# Altium project ArduinoUnoSheild.PrjPcb
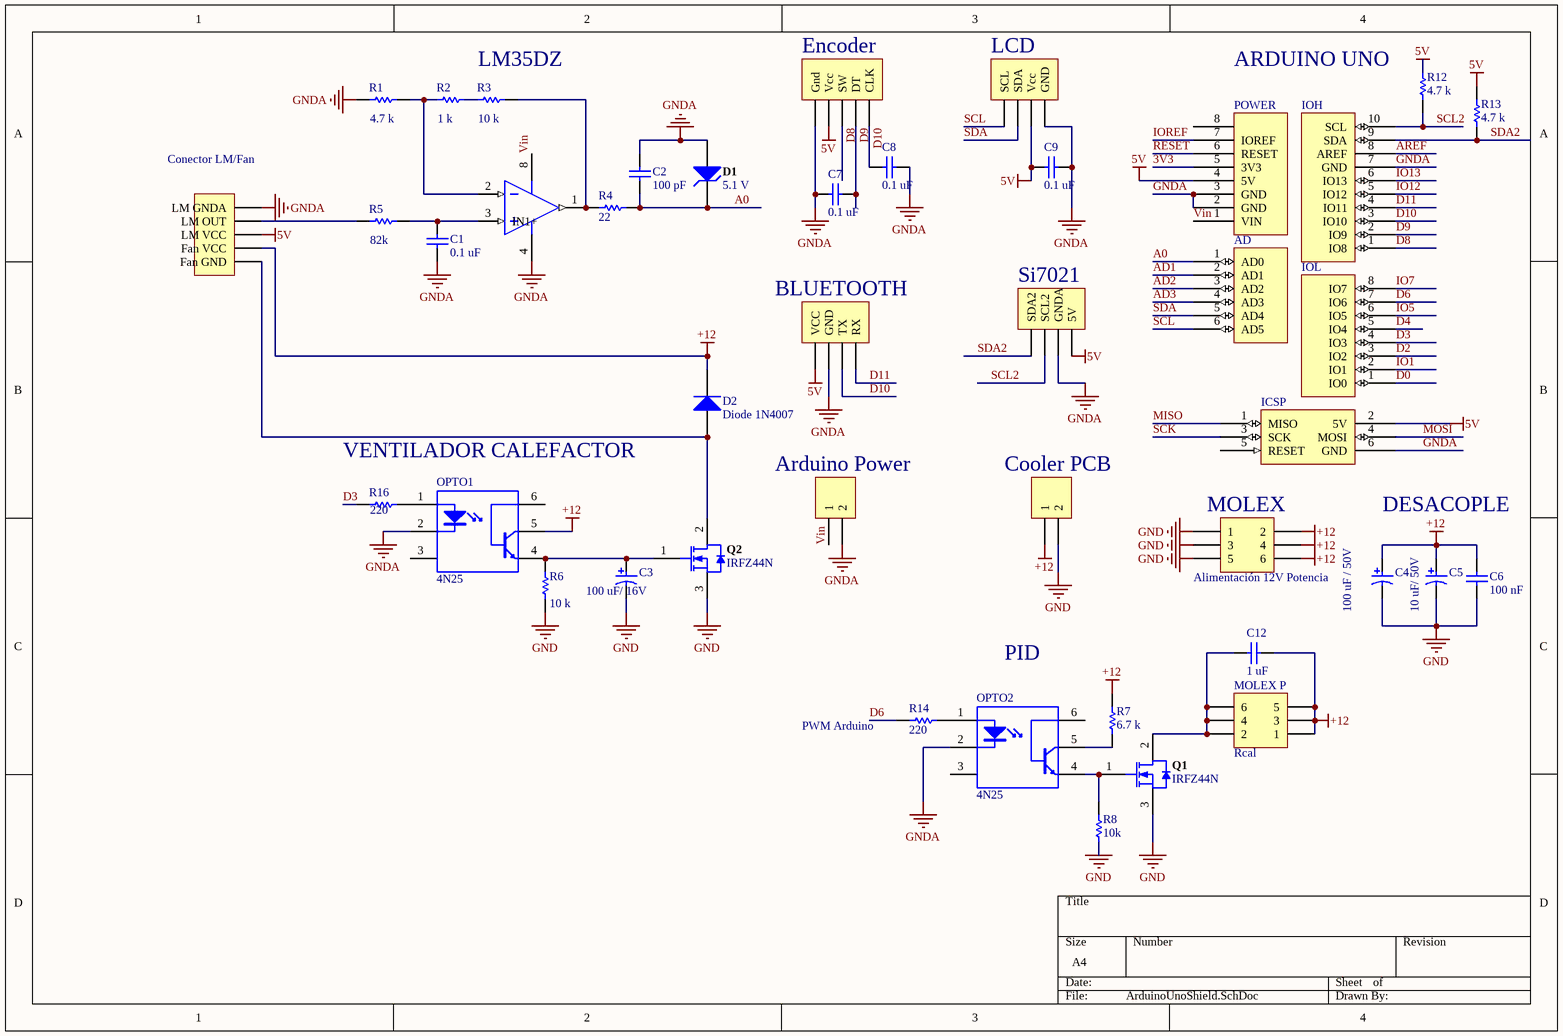
[diagram p0: ArduinoUnoShield.SchDoc]
1 sheet, 43 parts. Net scope: global (net labels, ports and power ports of the same name join across sheets).

## Sheet ArduinoUnoShield.SchDoc
size A4

### Parts
AD  AD  [Header 6x1 8.5mm]  (value not drawn)
Arduino_Power  Cooler  [HDR1X2]  (value not drawn)
BT  BLUETOOTH  [HDR1X4]
C1  0.1 uF  [KEMT-C315-THT-2]
C2  100 pF  [KEMT-C315-THT-2]
C3  100 uF/ 16V  [CAPPR55-250-1120X630X1220]
C4  100 uF / 50V  [CAPPR55-250-1120X630X1220]
C5  10 uF/ 50V  [CAPPR55-250-1120X630X1220]
C6  100 nF  [KEMT-C315-THT-2]
C7  0.1 uF  [KEMT-C315-THT-2]
C8  0.1 uF  [KEMT-C315-THT-2]
C9  0.1 uF  [KEMT-C315-THT-2]
C12  1 uF  [KEMT-C315-THT-2]
Conector_LM/Fan  Header 5  [HDR1X5]  (value not drawn)
Cooler_PCB  Cooler  [HDR1X2]  (value not drawn)
D1  5.1 V  [FAIR-DO-41-2_V]
D2  Diode 1N4007  [DO-41]
Encoder  Encoder  [HDR1X5]  (value not drawn)
ICSP  ICSP  [ICSP]  (value not drawn)
IOH  IOH  [Header 10x1 8.5mm]  (value not drawn)
IOL  IOL  [Header 8x1 8.5mm]  (value not drawn)
LCD  LCD  [HDR1X4]  (value not drawn)
MOLEX  Alimentación 12V Potencia  [HDR2X3]
MOLEX_P  Rcal  [HDR2X3]
OPTO1  4N25  [LTST-DIP-6_A]
OPTO2  4N25  [LTST-DIP-6_A]
POWER  POWER_UNO  [Header 8x1 8.5mm]  (value not drawn)
Q1  IRFZ44N  [VISH-TO-220AB-3_A]
Q2  IRFZ44N  [VISH-TO-220AB-3_A]
R1  4.7 k  [AXIAL-0.3]
R2  1 k  [AXIAL-0.3]
R3  10 k  [AXIAL-0.3]
R4  22  [AXIAL-0.3]
R5  82k  [AXIAL-0.3]
R6  10 k  [AXIAL-0.3]
R7  6.7 k  [AXIAL-0.3]
R8  value 10k  [AXIAL-0.3]  (hidden comment: 10 k)
R12  4.7 k  [AXIAL-0.3]
R13  4.7 k  [AXIAL-0.3]
R14  220  [AXIAL-0.3]
R16  220  [AXIAL-0.3]
Si7021  (no value)  [HDR1X4]
U1  (no value)  [ONSC-PDIP-8-626-05]  (part A of 2)

### Nets
5V: BT.1(VCC) C9.2 Conector_LM/Fan.4(LM_VCC) Encoder.2(Vcc) ICSP.2(5V) LCD.3(Vcc) POWER.4(5V) R12.2 R13.2 Si7021.4(5V)
+12: C4.1 C5.1 C6.2 C12.1 Conector_LM/Fan.2(Fan_VCC) Cooler_PCB.1 D2.2(K) MOLEX.2 MOLEX.4 MOLEX.6 MOLEX_P.1 MOLEX_P.3 MOLEX_P.5 OPTO1.5(C) R7.2
GND: C3.2 C4.2 C5.2 C6.1 Cooler_PCB.2 MOLEX.1 MOLEX.3 MOLEX.5 Q1.3(S) Q2.3(S) R6.2 R8.1
GNDA: Arduino_Power.2 BT.2(GND) C1.1 C2.1 C7.1 C8.2 C9.1 Conector_LM/Fan.5(LM_GNDA) D1.1(A) Encoder.1(Gnd) ICSP.6(GND) IOH.7(GND) LCD.4(GND) OPTO1.2(C) OPTO2.2(C) POWER.2(GND) POWER.3(GND) R1.1 Si7021.3(GNDA) U1.4(VEE)
3V3: POWER.5(3V3)
A0: AD.1(AD0) C2.2 D1.2(K) R4.1
AD1: AD.2(AD1)
AD2: AD.3(AD2)
AD3: AD.4(AD3)
AREF: IOH.8(AREF)
D0: IOL.1(IO0)
D2: IOL.3(IO2)
D3: IOL.4(IO3) R16.1
D4: IOL.5(IO4)
D6: IOL.7(IO6) R14.2
D8: Encoder.3(SW) IOH.1(IO8)
D9: C7.2 Encoder.4(DT) IOH.2(IO9)
D10: BT.3(TX) C8.1 Encoder.5(CLK) IOH.3(IO10)
D11: BT.4(RX) IOH.4(IO11)
IO1: IOL.2(IO1)
IO5: IOL.6(IO5)
IO7: IOL.8(IO7)
IO12: IOH.5(IO12)
IO13: IOH.6(IO13)
IOREF: POWER.7(IOREF)
MISO: ICSP.1(MISO)
MOSI: ICSP.4(MOSI)
RESET: POWER.6(RESET)
SCK: ICSP.3(SCK)
SCL: AD.6(AD5) LCD.1(SCL)
SCL2: IOH.10(SCL) R12.1 Si7021.2(SCL2)
SDA: AD.5(AD4) LCD.2(SDA)
SDA2: IOH.9(SDA) R13.1 Si7021.1(SDA2)
Vin: Arduino_Power.1 POWER.1(VIN) U1.8(VCC)
NetC1_2: C1.2 R5.2 U1.3(IN1+)
NetC3_1: C3.1 OPTO1.4(E) Q2.1(G) R6.1
NetC12_2: C12.2 MOLEX_P.2 MOLEX_P.4 MOLEX_P.6 Q1.2(D)
NetConector_LM/Fan_1: Conector_LM/Fan.1(Fan_GND) D2.1(A) Q2.2(D)
NetConector_LM/Fan_3: Conector_LM/Fan.3(LM_OUT) R5.1
NetOPTO1_1: OPTO1.1(A) R16.2
NetOPTO2_1: OPTO2.1(A) R14.1
NetOPTO2_4: OPTO2.4(E) Q1.1(G) R8.2
NetOPTO2_5: OPTO2.5(C) R7.1
NetR1_2: R1.2 R2.1 U1.2(IN1-)
NetR2_2: R2.2 R3.1
NetR3_2: R3.2 R4.2 U1.1(OUT1)

Not connected (* = marked no-connect by the designer): ICSP 5(RESET); OPTO1 3(NC) 6(B); OPTO2 3(NC) 6(B); POWER 8

### Notes on the sheet
- LM35DZ
- ARDUINO UNO
- VENTILADOR CALEFACTOR
- DESACOPLE
- PID
- (near R14) PWM Arduino

### Library data of the parts
Arduino_Power Cooler_PCB = Header 2: Header, 2-Pin; LatestRevisionDate: 17-Jul-2002; LatestRevisionNote: Re-released for DXP Platform.; Publisher: Altium Limited
BT LCD Si7021 = Header 4: Header, 4-Pin; LatestRevisionDate: 17-Jul-2002; LatestRevisionNote: Re-released for DXP Platform.; Publisher: Altium Limited
C1 C2 C6-C9 C12 = CMP-1664-00010-1: Capacitor, Ceramic, 1000 pF, +/-10 %, 100 V, X7R, -55 to 125 degC, 2-Pin THD, RoHS, Bulk; Max Supply Voltage: 3.6 V; Case\Package: DFN; Nominal Supply Voltage: 3 V; Min Supply Voltage: 1.5 V; Interface: Serial; ComponentLink1Description: Manufacturer URL; ComponentLink1URL: http://www.kemet.com/; DatasheetVersion: Aug-16; Max Operating Temperature: 125 degC; REACH SVHC: Unknown; Min Operating Temperature: -40 degC; Radiation Hardening: No; Mount: Surface Mount; Packaging: Tape and Reel; PackageDescription: 2-Pin Through Hole Device, Body 3.81 x 2.54 mm; RoHSCompliant: true; PackageReference: C315-THT-2; ComponentLink2URL: http://capacitoredge.kemet.com/capedge2/DataSheet/Datasheet-C315C102K1R5TA.pdf?pn=C315C102K1R5TA{BULK}; ComponentLink2Description: Datasheet; Pins: 6
C3-C5 = CMP-1665-00035-2: Aluminum Electrolytic Capacitor, 22 uF, +/- 20%, 100 V, -40 to 85 degC, 2-Pin THD, RoHS, Bulk; Nominal Vf: 2.1 V; Luminous Intensity: 2 mcd; Viewing Angle: 130 degrees; Lens Style: Clear; Colour: Orange; Forward Current: 20 mA; Case\Package: 0603; ComponentLink2URL: https://industrial.panasonic.com/cdbs/www-data/pdf/RDF0000/ABA0000C1047.pdf; Height: 1.1 mm; Max Operating Temperature: 85 degC; Width: 0.8 mm; ComponentLink1Description: Manufacturer URL; Min Operating Temperature: -55 degC; Package Quantity: 3000; RoHSCompliant: true; DatasheetVersion: Mar-16; Length: 1.6 mm; ComponentLink1URL: http://www.panasonic.com/; Packaging: Tape and Reel; Case Code (Imperial): 0603; Radiation Hardening: No; ComponentLink2Description: Datasheet; Mount: Surface Mount; PackageDescription: 2-Pin Through Hole Device, Dia 6.3 mm, Body Length 11.2 mm; Pins: 2; PackageReference: Radial; Illumination Colour: Orange; Case Code (Metric): 1608; Forward Voltage: 2.1 V
Conector_LM/Fan Encoder = Header 5: Header, 5-Pin; LatestRevisionDate: 17-Jul-2002; LatestRevisionNote: Re-released for DXP Platform.; Publisher: Altium Limited
D1 = CMP-0892-00023-1: Zener Diode, 18V, 1W, 5%, -65 to 200 degC, 2-Pin DO-41, Body 2.72 x 5.2 mm, RoHS; Manufacturer: Fairchild Semiconductor; PartNumber: 1N4746A; VZ (Max.) (V): 18.9; IR (uA): 5; Test Current IZ (mA): 14; VZ (Min.) (V): 17.1; ZZ (Max) (ohm): 16; PD (W): 1; Operating and Storage Temperature Range: -65 to 200 degC; RoHS: TRUE; ComponentLink1URL: http://www.fairchildsemi.com/; DatasheetVersion: Rev. H3; ComponentLink2Description: Datasheet; ComponentLink3Description: Package Specification; Tolerance: 5%; ComponentLink3URL: http://www.fairchildsemi.com/dwg/DO/DO41A.pdf; PackageVersion: Rev. 2; ComponentLink2URL: http://www.fairchildsemi.com/ds/1N/1N4744A.pdf; Mounting Technology: Through Hole; PackageDescription: 2-Pin Axial leaded, Body 2.72 x 5.2 mm, Lead Spread 25.4 mm; PackageReference: DO-41-2; ComponentLink1Description: Manufacturer URL
D2 = Diode 1N4007: 1 Amp General Purpose Rectifier; Published: 8-Jun-2000; LatestRevisionDate: 17-Jul-2002; LatestRevisionNote: Re-released for DXP Platform.; DatasheetVersion: 1998; PackageVersion: Aug-1999; PackageReference: DO-41; Publisher: Altium Limited; PackageDescription: Diode, Axial; Body 5.2 x 2.7 mm (LxDia. max), Lead Dia. 0.86 mm (max); Code_JEDEC: DO-204-AL; ComponentLink1Description: Manufacturer Link; ComponentLink1URL: http://www.fairchildsemi.com/; ComponentLink2Description: Datasheet; ComponentLink2URL: http://www.fairchildsemi.com/ds/1N%2F1N4001.pdf
MOLEX MOLEX_P = Header 3X2: Header, 3-Pin, Dual row; LatestRevisionDate: 17-Jul-2002; LatestRevisionNote: Re-released for DXP Platform.; Publisher: Altium Limited
OPTO1 OPTO2 = CMP-2000-05615-1: Photocoupler - Phototransistor Output, 1500 Vrms, -55 to 100 degC, 6-Pin DIP, RoHS, Tube; Manufacturer: Vishay; Maximum Input Diode Current: 60mA; Output Type: DC; Maximum Collector Current: 100mA; Isolation Voltage: 5000Vrms; Maximum Power Dissipation: 70mW; Maximum Reverse Diode Voltage: 6V; Current Transfer Ratio: 50%; Number of Channels: 1Channel; Output Device: NPNPhototransistor; Brand: VishaySemiconductors; Maximum Forward Diode Voltage: 1.5V; Maximum Collector Emitter Voltage: 30V; RoHS: Details; Package Description: 6-Pin Double In-line Package, Body 7.3 x 6.5 mm, Pitch 2.54 mm; Product Category: TransistorOutputOptocouplers; Packaging: Tube; Manufacturer URL: http://www.us.liteon.com/; Minimum Operating Temperature: -55C; Package Reference: DIP-6; Input Type: DC; Datasheet Version: Rev. D, 12/2015; Datasheet URL: http://optoelectronics.liteon.com/upload/download/DS-70-99-0012/S_110_4N3X%20Series%201115.pdf; Maximum Operating Temperature: +100C; Package / Case: PDIP-6; Forward Current: 60mA; Configuration: 1Channel; Factory Pack Quantity: 3000; Number of Channels per Chip: 1Channel; Mounting Technology: ThroughHole
Q1 Q2 = CMP-2000-06461-1: Power MOSFET, 100 VDS, -55 to 175 degC, 3-Pin TO-220AB, RoHS, Tube; Manufacturer: Vishay; Typical Turn-Off Delay Time: 53ns; Channel Mode: Enhancement; Unit Weight: 0.211644oz; Transistor Type: 1N-Channel; Vgs - Gate-Source Voltage: 20V; Transistor Polarity: N-Channel; Vds - Drain-Source Breakdown Voltage: 100V; Configuration: Single; Number of Channels: 1Channel; Pd - Power Dissipation: 150W; Brand: VishaySemiconductors; Rds On - Drain-Source Resistance: 77mOhms; Id - Continuous Drain Current: 28A; Rise Time: 44ns; Fall Time: 43ns; Typical Turn-On Delay Time: 11ns; &lt;PCN&gt;: http://www.mouser.com/PCN/Vishay_SIL_0182015.pdf; Maximum Operating Temperature: +175C; Product Category: MOSFET; Datasheet URL: http://www.vishay.com/docs/91021/91021.pdf; Length: 10.51mm; Height: 9.01mm; Factory Pack Quantity: 50; Width: 4.7mm; Packaging: Tube; Package Reference: TO-220AB-3; Package / Case: TO-220-3; Mounting Style: ThroughHole; Manufacturer URL: http://www.vishay.com/; Mounting Technology: ThroughHole; Package URL: http://www.vishay.com/docs/71195/to220ab.pdf; RoHS: NoRoHSVersionAvailable; Technology: Si; Minimum Operating Temperature: -55C; Package Description: 3-Pin Flange Mount, Body 10.275 x 4.45 mm, Pitch 2.54 mm; Datasheet Version: Rev. B, 03/2011
R1 R4-R8 R12-R14 R16 = Res1: Resistor; Published: 8-Jun-2000; LatestRevisionDate: 17-Jul-2002; LatestRevisionNote: Re-released for DXP Platform.; PackageReference: AXIAL-0.3; Publisher: Altium Limited; PackageDescription: Axial Device, Thru-Hole; 2 Leads; 0.3 in Pin Spacing
  R1 R12 R13: Value: 4.7 k
  R4: Value: 22
  R5: Value: 82k
  R6: Value: 10 k
  R14 R16: Value: 220
R2 R3 = Res1: Published: 8-Jun-2000; LatestRevisionDate: 17-Jul-2002; LatestRevisionNote: Re-released for DXP Platform.; PackageReference: AXIAL-0.3; Publisher: Altium Limited; PackageDescription: Axial Device, Thru-Hole; 2 Leads; 0.3 in Pin Spacing
  R2: Value: 1 k
  R3: Value: 10 k
U1 = CMP-1310-00079-1: Low Voltage, Rail-to-Rail Operational Amplifier, 1.8 to 12 V, -40 to 105 degC, 8-Pin PDIP, Tube; Manufacturer: On Semiconductor; PartNumber: MC33202P; VCC Max (V): 12; GBW Typ (MHz): 2.2; SR Typ (V/uS): 1; VCC Min (V): 1.8; ComponentLink3Description: Package Specification; DatasheetVersion: Rev. 17; RoHS: FALSE; PackageVersion: Rev. N, 06/2013; PackageReference: PDIP-8-626-05; ComponentLink2Description: Datasheet; Mounting Technology: Through Hole; PackageDescription: 8-Pin Plastic Dual-In Line Package, Body 9.59 x 6.605 mm, Pitch 2.54 mm; ComponentLink1Description: Manufacturer URL; ComponentLink3URL: http://www.onsemi.cn/pub_link/Collateral/626-05.PDF; ComponentLink1URL: http://www.onsemi.com/; Packing: Tube; ComponentLink2URL: http://www.onsemi.cn/pub_link/Collateral/MC33201-D.PDF
AD = AD: Supplier 1: Arrow; Supplier Part Number 1: 2699089; Supplier 2: Digi-Key; Supplier Part Number 2: SAM1198-06-ND; Supplier 3: Arrow; Supplier Part Number 3: 2699088; Supplier 4: Arrow; Supplier Part Number 4: 2699075
ICSP = ICSP: Supplier 1: Arrow; Supplier Part Number 1: 2699117; Supplier 2: Arrow; Supplier Part Number 2: 2699116; Supplier 3: Digi-Key; Supplier Part Number 3: SAM1185-06-ND; Supplier 4: Arrow; Supplier Part Number 4: 2699091; Supplier 5: Digi-Key; Supplier Part Number 5: SAM1196-06-ND
IOH = IOH: Supplier 1: Arrow; Supplier Part Number 1: 2698803S4475693N1004; Supplier 2: Digi-Key; Supplier Part Number 2: SAM1198-10-ND; Supplier 3: Arrow; Supplier Part Number 3: 2698789
IOL = IOL: Supplier 1: Digi-Key; Supplier Part Number 1: SAM1198-08-ND; Supplier 2: Arrow; Supplier Part Number 2: 2698939; Supplier 3: Arrow; Supplier Part Number 3: 2698940; Supplier 4: Arrow; Supplier Part Number 4: 2698925
POWER = POWER_UNO: Supplier 1: Digi-Key; Supplier Part Number 1: SAM1198-08-ND; Supplier 2: Arrow; Supplier Part Number 2: 2698939; Supplier 3: Arrow; Supplier Part Number 3: 2698940; Supplier 4: Arrow; Supplier Part Number 4: 2698925